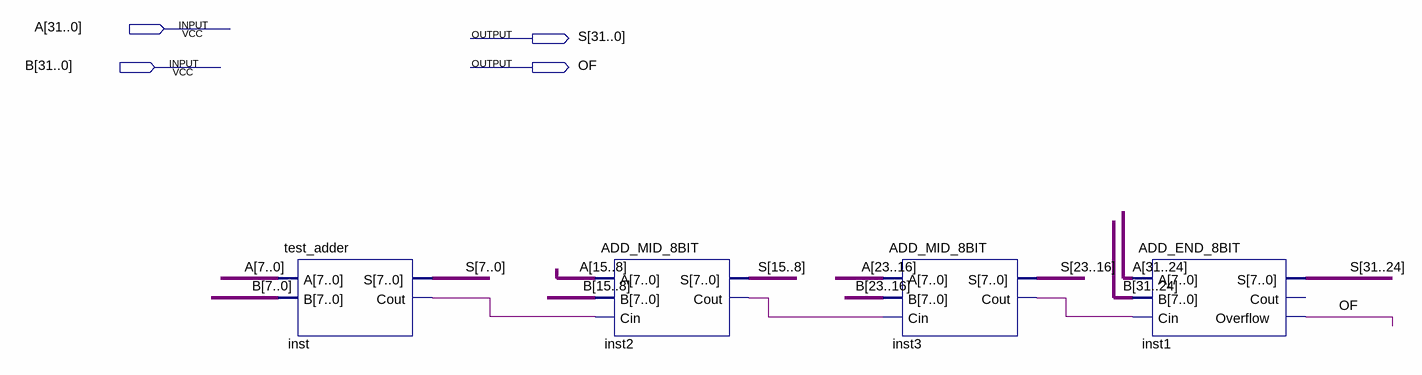
[diagram p0: schematic sheet]
// Quartus schematic test_32bit_adder.bdf as structural Verilog: 4 symbols, 4 pins
module test_32bit_adder (
  input  [31:0] A,
  input  [31:0] B,
  output [31:0] S,
  output OF
);

  wire inst2_cout, inst3_cout, inst_cout;

  test_adder inst (.A(A[7:0]), .B(B[7:0]), .S(S[7:0]), .Cout(inst_cout));
  ADD_MID_8BIT inst2 (.A(A[15:8]), .B(B[15:8]), .Cin(inst_cout), .S(S[15:8]), .Cout(inst2_cout));
  ADD_MID_8BIT inst3 (.A(A[23:16]), .B(B[23:16]), .Cin(inst2_cout), .S(S[23:16]), .Cout(inst3_cout));
  ADD_END_8BIT inst1 (.A(A[31:24]), .B(B[31:24]), .Cin(inst3_cout), .S(S[31:24]), .Overflow(OF));  // open: Cout
endmodule
